# EAGLE design M7102 (EAGLE 6.6.0)
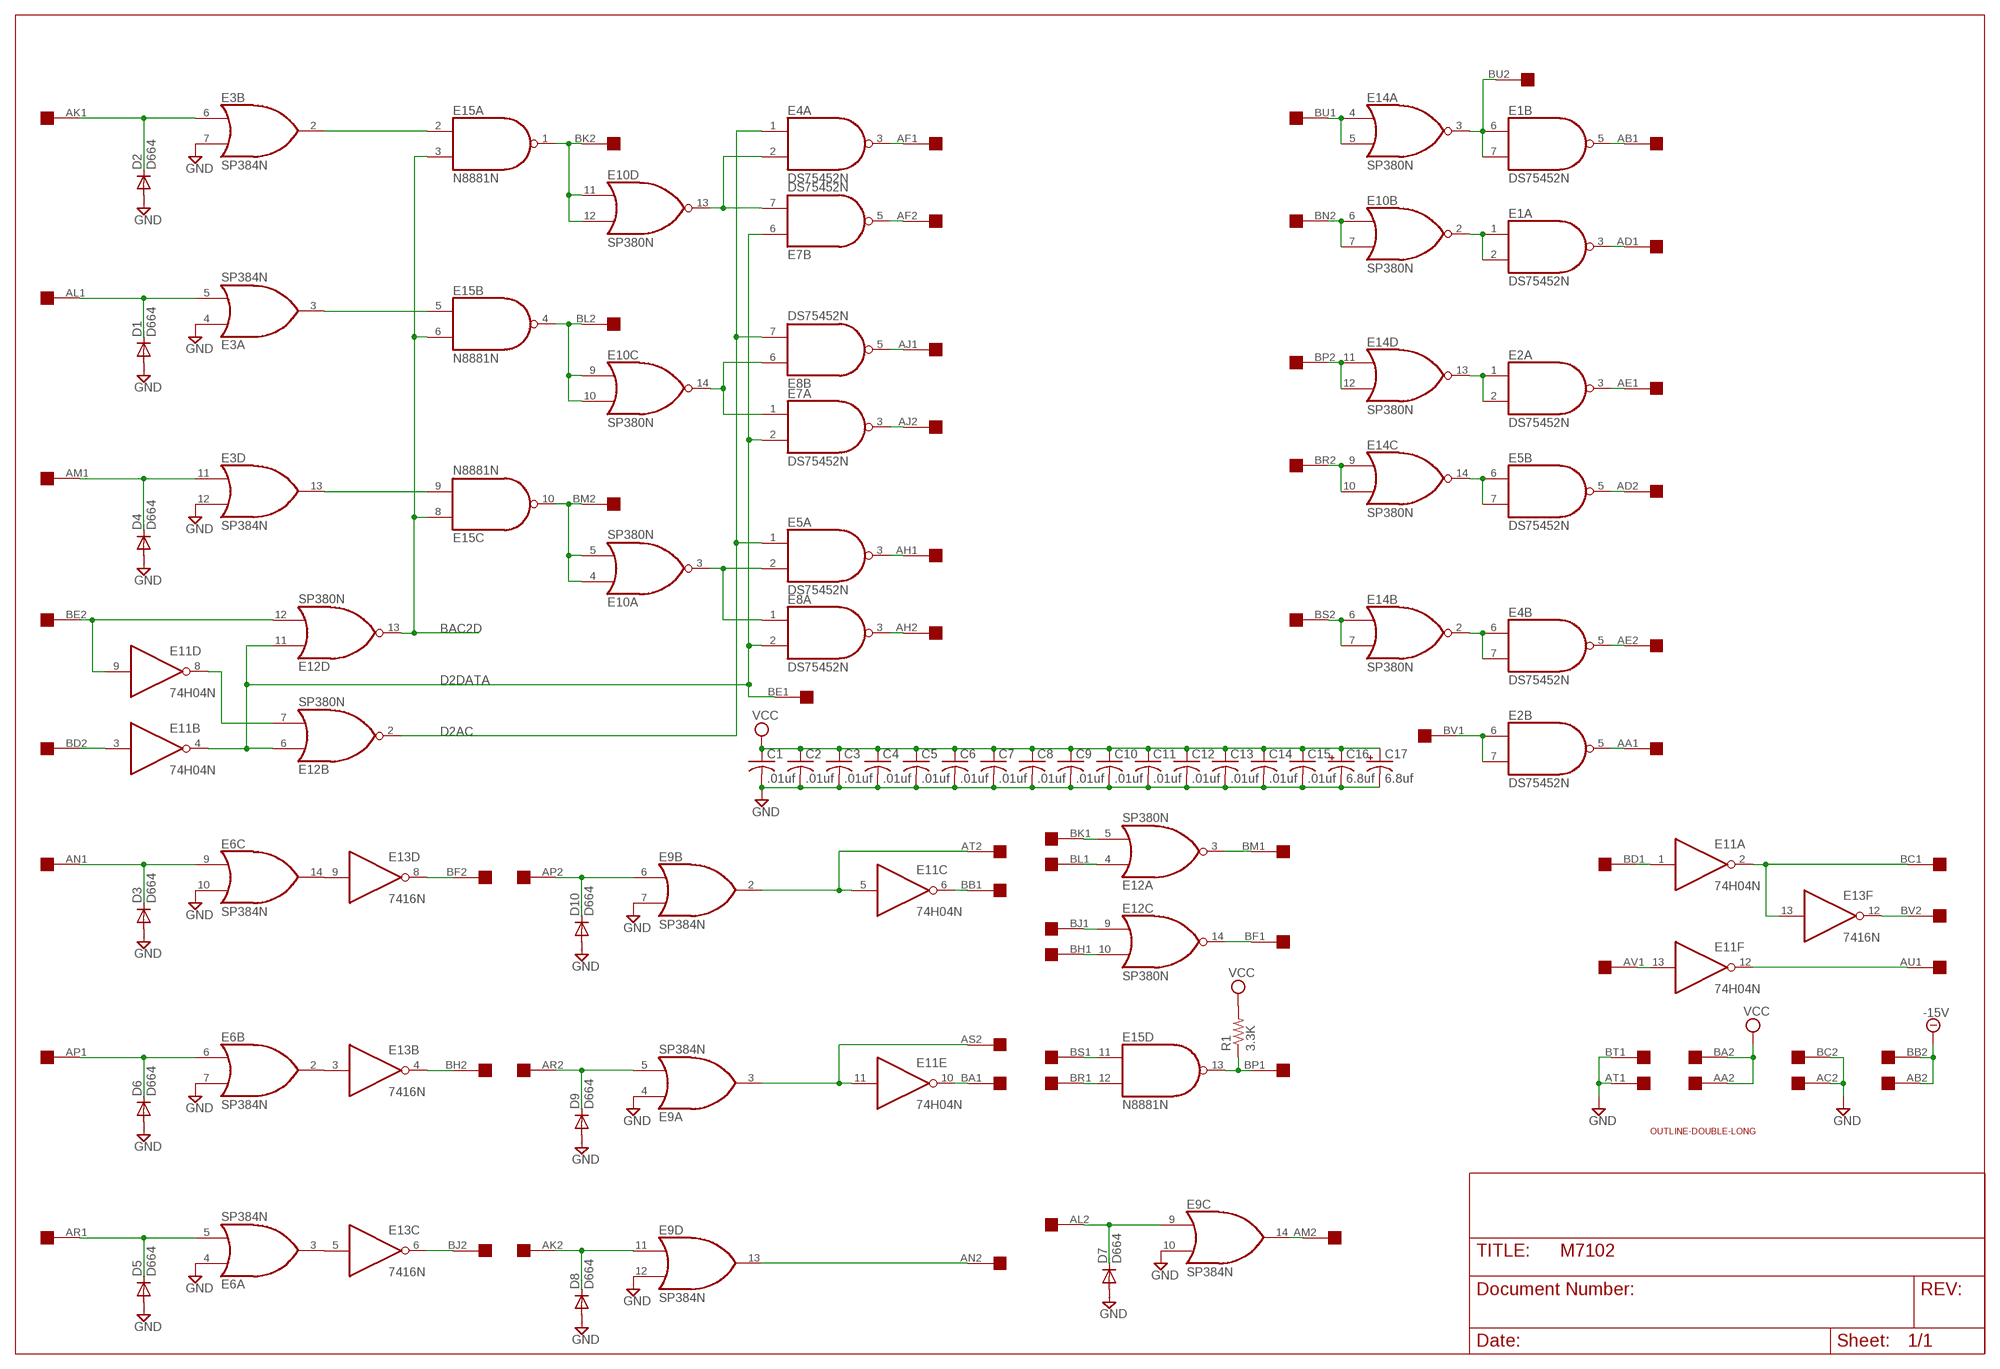
[diagram p0: schematic, sheet 1]

## Parts
C1  .01uf  C-US050-025X075  [C050-025X075]
C2  .01uf  C-US050-025X075  [C050-025X075]
C3  .01uf  C-US050-025X075  [C050-025X075]
C4  .01uf  C-US050-025X075  [C050-025X075]
C5  .01uf  C-US050-025X075  [C050-025X075]
C6  .01uf  C-US050-025X075  [C050-025X075]
C7  .01uf  C-US050-025X075  [C050-025X075]
C8  .01uf  C-US050-025X075  [C050-025X075]
C9  .01uf  C-US050-025X075  [C050-025X075]
C10  .01uf  C-US050-025X075  [C050-025X075]
C11  .01uf  C-US050-025X075  [C050-025X075]
C12  .01uf  C-US050-025X075  [C050-025X075]
C13  .01uf  C-US050-025X075  [C050-025X075]
C14  .01uf  C-US050-025X075  [C050-025X075]
C15  .01uf  C-US050-025X075  [C050-025X075]
C16  6.8uf  CPOL-USE15-5AXIAL  [E15-5]
C17  6.8uf  CPOL-USE15-5AXIAL  [E15-5]
D1  D664  1N4148DO35-10  [DO35-10]
D2  D664  1N4148DO35-10  [DO35-10]
D3  D664  1N4148DO35-10  [DO35-10]
D4  D664  1N4148DO35-10  [DO35-10]
D5  D664  1N4148DO35-10  [DO35-10]
D6  D664  1N4148DO35-10  [DO35-10]
D7  D664  1N4148DO35-10  [DO35-10]
D8  D664  1N4148DO35-10  [DO35-10]
D9  D664  1N4148DO35-10  [DO35-10]
D10  D664  1N4148DO35-10  [DO35-10]
E1  DS75452N  [DIL08]
E2  DS75452N  [DIL08]
E3  SP384N  [DIL14]
E4  DS75452N  [DIL08]
E5  DS75452N  [DIL08]
E6  SP384N  [DIL14]
E7  DS75452N  [DIL08]
E8  DS75452N  [DIL08]
E9  SP384N  [DIL14]
E10  SP380N  [DIL14]
E11  74H04N  7404N  [DIL14]
E12  SP380N  [DIL14]
E13  7416N  [DIL14]
E14  SP380N  [DIL14]
E15  N8881N  [DIL14]
EDGE  DOUBLE  [EDGE-CON4]
R1  3.3K  R-US_0207/10  [0207/10]
U$3  OUTLINE-DOUBLE-LONG  [DOUBLE-LONG]

## Nets
-15V [Supply]: EDGE.AB2 EDGE.BB2
AN1: D3.C E6.9(C:I0) EDGE.AN1
AP1: D6.C E6.6(B:I0) EDGE.AP1
AR1: D5.C E6.5(A:I1) EDGE.AR1
BAC2D: E12.13(D:O) E15.3(A:I1) E15.6(B:I1) E15.8(C:I0)
BD2: E11.3(B:I) EDGE.BD2
BE2: E11.9(D:I) E12.12(D:I1) EDGE.BE2
D2AC: E4.1(A:I0) E5.1(A:I0) E8.7(B:I1) E12.2(B:O)
D2DATA: E7.2(A:I1) E7.6(B:I0) E8.2(A:I1) E11.4(B:O) E12.6(B:I0) E12.11(D:I0) EDGE.BE1
GND [Supply]: C1.2 C2.2 C3.2 C4.2 C5.2 C6.2 C7.2 C8.2 C9.2 C10.2 C11.2 C12.2 C13.2 C14.2 C15.2 C16.- C17.- D1.A D2.A D3.A D4.A D5.A D6.A D7.A D8.A D9.A D10.A E3.4(A:I0) E3.7(B:I1) E3.12(D:I1) E6.4(A:I0) E6.7(B:I1) E6.10(C:I1) E9.4(A:I0) E9.7(B:I1) E9.10(C:I1) E9.12(D:I1) EDGE.AC2 EDGE.AT1 EDGE.BC2 EDGE.BT1
N$1: D4.C E3.11(D:I0) EDGE.AM1
N$2: D1.C E3.5(A:I1) EDGE.AL1
N$3: D2.C E3.6(B:I0) EDGE.AK1
N$4: E3.2(B:O) E15.2(A:I0)
N$5: E3.3(A:O) E15.5(B:I0)
N$6: E3.13(D:O) E15.9(C:I1)
N$7: E6.14(C:O) E13.9(D:I)
N$8: E6.2(B:O) E13.3(B:I)
N$9: E6.3(A:O) E13.5(C:I)
N$10: E4.3(A:O) EDGE.AF1
N$11: E7.5(B:O) EDGE.AF2
N$12: E8.5(B:O) EDGE.AJ1
N$13: E11.8(D:O) E12.7(B:I1)
N$14: D7.C E9.9(C:I0) EDGE.AL2
N$15: E10.4(A:I0) E10.5(A:I1) E15.10(C:O) EDGE.BM2
N$16: E10.9(C:I0) E10.10(C:I1) E15.4(B:O) EDGE.BL2
N$17: E10.11(D:I0) E10.12(D:I1) E15.1(A:O) EDGE.BK2
N$18: E13.6(C:O) EDGE.BJ2
N$19: E13.4(B:O) EDGE.BH2
N$20: E13.8(D:O) EDGE.BF2
N$21: E4.2(A:I1) E7.7(B:I1) E10.13(D:O)
N$22: E7.1(A:I0) E8.6(B:I0) E10.14(C:O)
N$23: E5.2(A:I1) E8.1(A:I0) E10.3(A:O)
N$24: E9.14(C:O) EDGE.AM2
N$25: D10.C E9.6(B:I0) EDGE.AP2
N$26: E5.3(A:O) EDGE.AH1
N$27: E7.3(A:O) EDGE.AJ2
N$28: E8.3(A:O) EDGE.AH2
N$29: E1.5(B:O) EDGE.AB1
N$30: E1.3(A:O) EDGE.AD1
N$31: E2.3(A:O) EDGE.AE1
N$32: E5.5(B:O) EDGE.AD2
N$33: E4.5(B:O) EDGE.AE2
N$34: E2.5(B:O) EDGE.AA1
N$35: D9.C E9.5(A:I1) EDGE.AR2
N$36: D8.C E9.11(D:I0) EDGE.AK2
N$37: E9.13(D:O) EDGE.AN2
N$38: E1.6(B:I0) E1.7(B:I1) E14.3(A:O) EDGE.BU2
N$39: E1.1(A:I0) E1.2(A:I1) E10.2(B:O)
N$40: E14.4(A:I0) E14.5(A:I1) EDGE.BU1
N$41: E10.6(B:I0) E10.7(B:I1) EDGE.BN2
N$66: E2.1(A:I0) E2.2(A:I1) E14.13(D:O)
N$67: E5.6(B:I0) E5.7(B:I1) E14.14(C:O)
N$68: E2.6(B:I0) E2.7(B:I1) EDGE.BV1
N$69: E4.6(B:I0) E4.7(B:I1) E14.2(B:O)
N$70: E14.6(B:I0) E14.7(B:I1) EDGE.BS2
N$71: E14.9(C:I0) E14.10(C:I1) EDGE.BR2
N$72: E14.11(D:I0) E14.12(D:I1) EDGE.BP2
N$74: E9.2(B:O) E11.5(C:I) EDGE.AT2
N$78: E9.3(A:O) E11.11(E:I) EDGE.AS2
N$88: E11.6(C:O) EDGE.BB1
N$89: E11.10(E:O) EDGE.BA1
N$91: E12.4(A:I0) EDGE.BL1
N$92: E12.5(A:I1) EDGE.BK1
N$93: E12.3(A:O) EDGE.BM1
N$94: E12.14(C:O) EDGE.BF1
N$95: E12.10(C:I1) EDGE.BH1
N$96: E12.9(C:I0) EDGE.BJ1
N$97: E15.11(D:I0) EDGE.BS1
N$98: E15.12(D:I1) EDGE.BR1
N$99: E15.13(D:O) EDGE.BP1 R1.1
N$100: E11.2(A:O) E13.13(F:I) EDGE.BC1
N$101: E11.1(A:I) EDGE.BD1
N$102: E11.13(F:I) EDGE.AV1
N$103: E11.12(F:O) EDGE.AU1
N$104: E13.12(F:O) EDGE.BV2
VCC [Supply]: C1.1 C2.1 C3.1 C4.1 C5.1 C6.1 C7.1 C8.1 C9.1 C10.1 C11.1 C12.1 C13.1 C14.1 C15.1 C16.+ C17.+ EDGE.AA2 EDGE.BA2 R1.2
Unconnected: E3.9(C:I0) E3.10(C:I1) E3.14(C:O) E6.11(D:I0) E6.12(D:I1) E6.13(D:O) E13.1(A:I) E13.2(A:O) E13.10(E:O) E13.11(E:I) EDGE.AC1 EDGE.AS1 EDGE.AU2 EDGE.AV2 EDGE.BN1 EDGE.BT2

## Power pins joined to a net without a drawn wire
GND: E1.4(P:GND) E2.4(P:GND) E3.1(GND) E4.4(P:GND) E5.4(P:GND) E6.1(GND) E7.4(P:GND) E8.4(P:GND) E9.1(GND) E10.1(P:GND) E11.7(P:GND) E12.1(P:GND) E13.7(P:GND) E14.1(P:GND) E15.7(P:GND)
VCC: E1.8(P:VCC) E2.8(P:VCC) E3.8(VCC) E4.8(P:VCC) E5.8(P:VCC) E6.8(VCC) E7.8(P:VCC) E8.8(P:VCC) E9.8(VCC) E10.8(P:VCC) E11.14(P:VCC) E12.8(P:VCC) E13.14(P:VCC) E14.8(P:VCC) E15.14(P:VCC)

## Library data of the parts
C1-C15 = rcl:C-US: CAPACITOR, American symbol
C16 C17 = rcl:CPOL-US: POLARIZED CAPACITOR, American symbol
D1-D10 = diode:1N4148: DIODE high speed (Philips)
E1 E2 E4 E5 E7 E8 = dec-con:DS75452: Quad 2-input NAND gate, open collector output
E3 E6 E9 = dec-con:SP384: Quad OR gate
E10 E12 E14 = dec-con:SP380: Quad NOR gate (use 8640)
E11 = 74xx-us:74*04: Hex INVERTER
E13 = 74xx-us:74*16: Hex INVERTER, open collector, high-voltage
E15 = dec-con:N8881: Quad 2-input NAND gate, open collector
EDGE = dec-con:DOUBLE: Double-Height DEC board
R1 = rcl:R-US_: RESISTOR, American symbol
U$3 = dec-con:OUTLINE-*: Board outlines for DEC boards.

## Net classes
1 Supply: width 0.635 mm

## Board
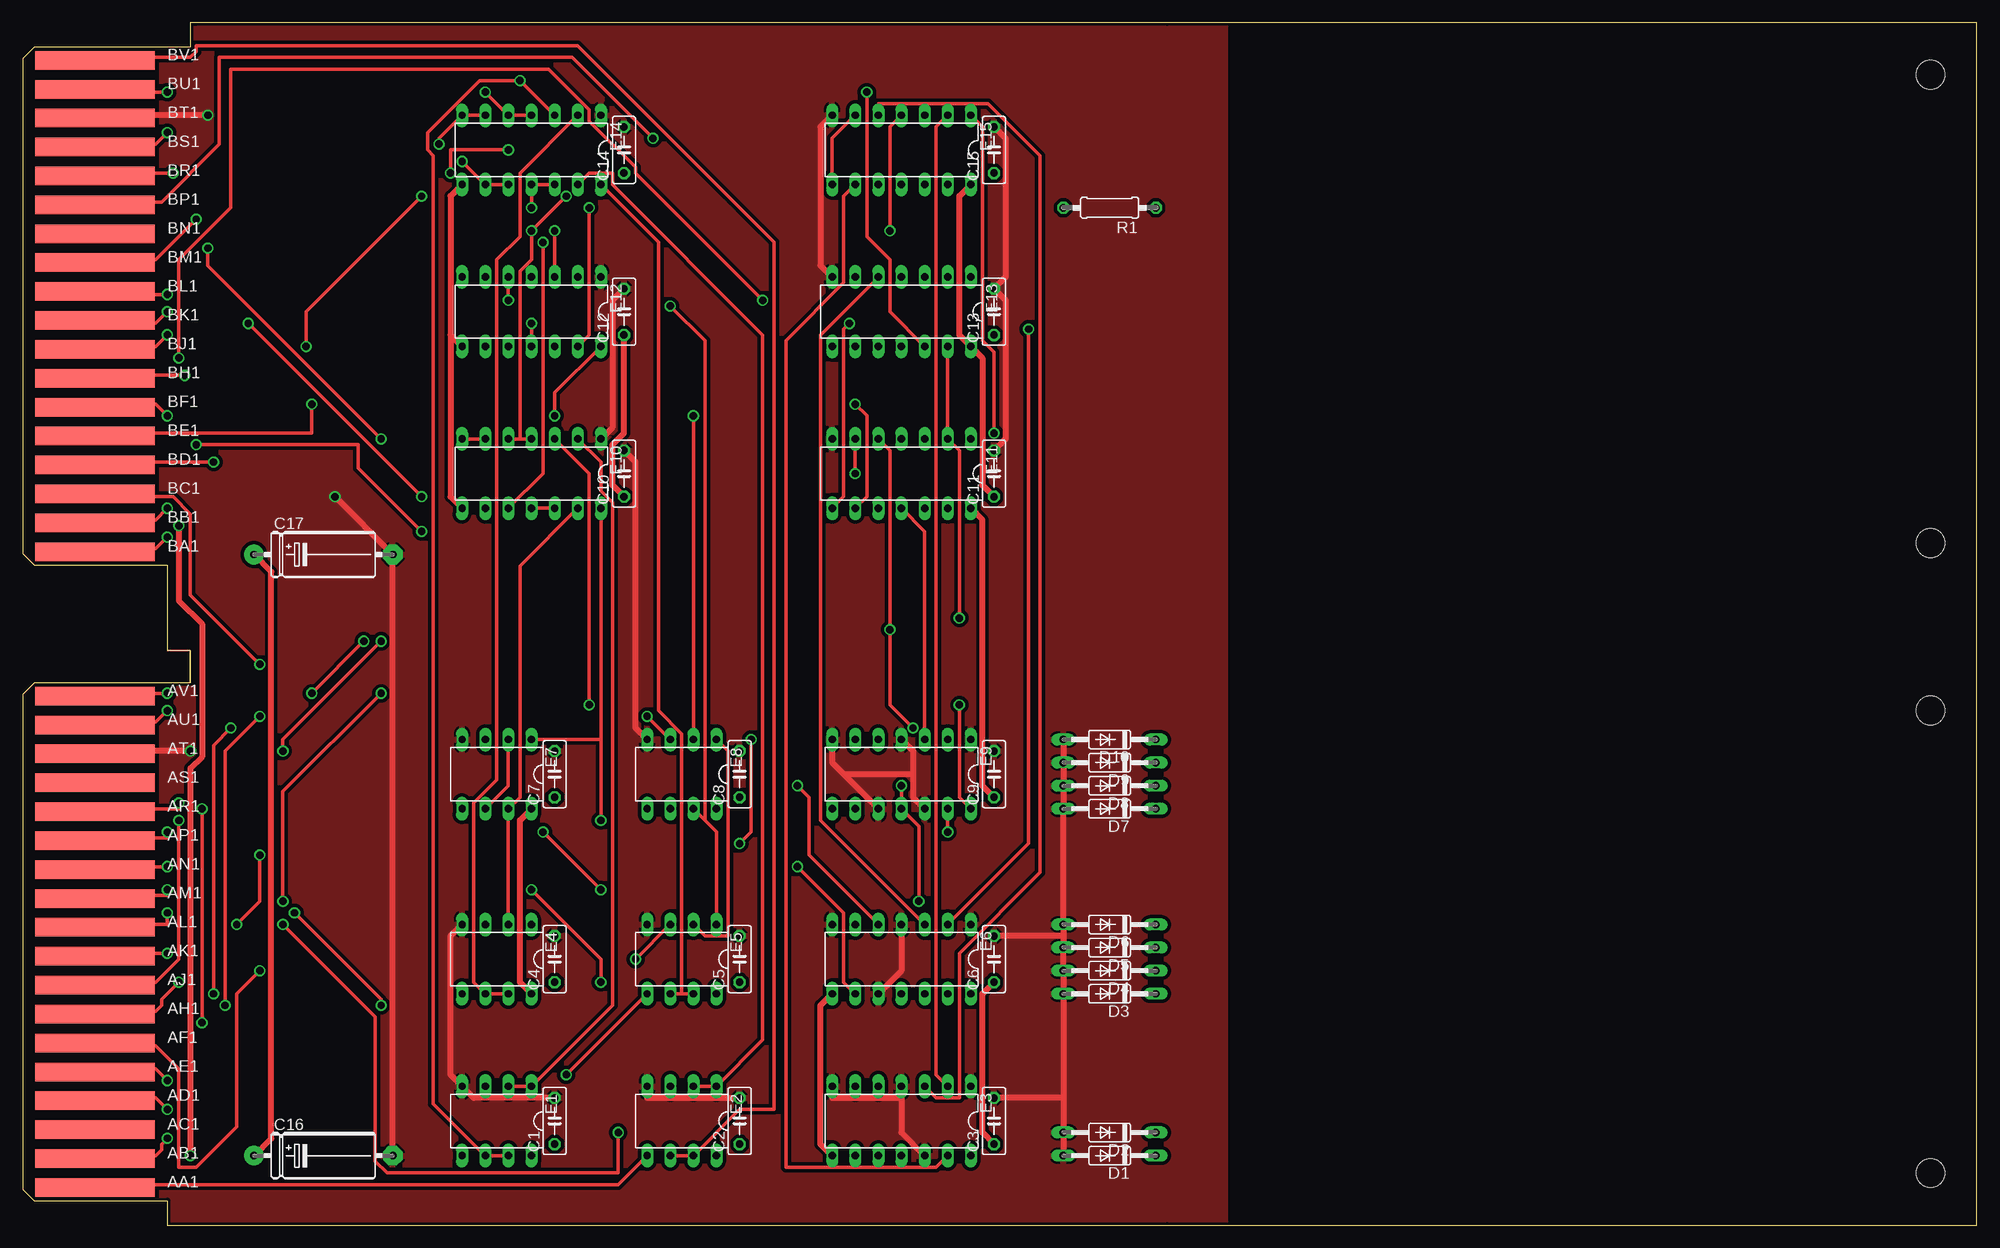
[diagram p1: board, top side]
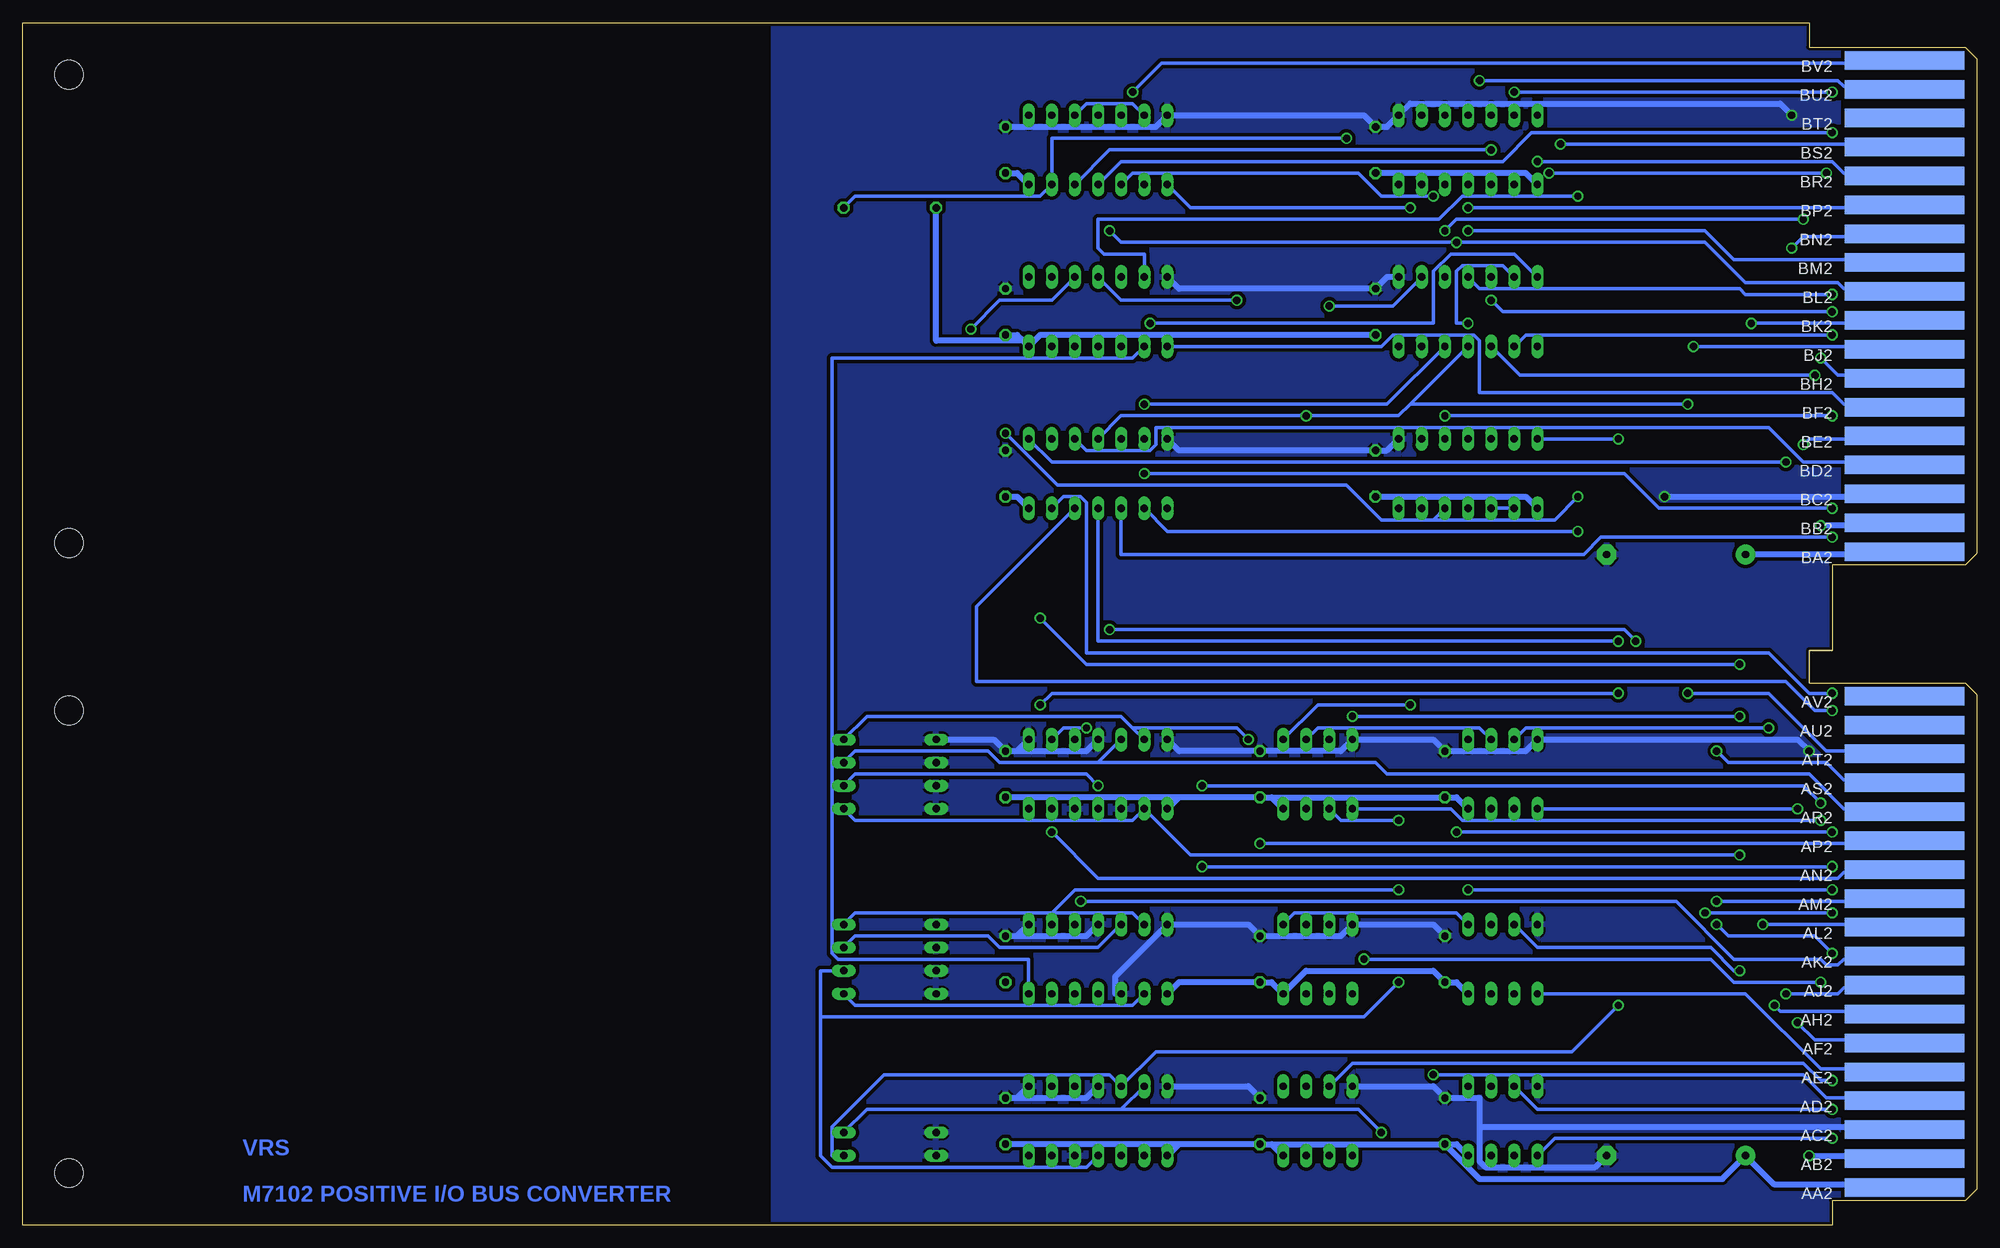
[diagram p2: board, bottom side, seen from below]

Size 214.63 x 132.08 mm. Coordinates in mm from the lower left corner, seen from the top.
Copper layers (1+16): Top 0.035mm / dielectric 1.5mm / Bottom 0.035mm
Design rules "16mils": minimum track width 16mil, minimum drill 32mil, track to track 15mil, track to pad 10mil, pad to pad 10mil, via to via 10mil, smd to smd 10mil, copper to edge 13mil, drill to drill 10mil, minimum pad ring 10mil, minimum via ring 8mil, stop-mask expansion 0mil, vias tented up to drill 0mil, thermal gap 10mil

### Footprints (pad centres in the part's own frame; a part is rotated, then mirrored left to right if it is on the bottom)
C050-025X075 = drill 0.813 octagon: 1 -2.54,0; 2 2.54,0
E15-5 = drill 0.813 pad 2.159: + -7.62,0 | drill 0.813 pad 2.159 octagon: - 7.62,0
DO35-10 = drill 0.813 long: A 5.08,0; C -5.08,0
DIL08 = drill 0.813 long: 1 -3.81,-3.81; 2 -1.27,-3.81; 3 1.27,-3.81; 4 3.81,-3.81; 5 3.81,3.81; 6 1.27,3.81; 7 -1.27,3.81; 8 -3.81,3.81
DIL14 = drill 0.813 long: 1 -7.62,-3.81; 2 -5.08,-3.81; 3 -2.54,-3.81; 4 0,-3.81; 5 2.54,-3.81; 6 5.08,-3.81; 7 7.62,-3.81; 8 7.62,3.81; 9 5.08,3.81; 10 2.54,3.81; 11 0,3.81; 12 -2.54,3.81; 13 -5.08,3.81; 14 -7.62,3.81
EDGE-CON4 = smd 13.106 x 2.032: AA1 7.938,4.128; AB1 7.938,7.303; AC1 7.938,10.477; AD1 7.938,13.652; AE1 7.938,16.828; AF1 7.938,20.003; AH1 7.938,23.177; AJ1 7.938,26.352; AK1 7.938,29.527; AL1 7.938,32.703; AM1 7.938,35.877; AN1 7.938,39.053; AP1 7.938,42.227; AR1 7.938,45.403; AS1 7.938,48.578; AT1 7.938,51.752; AU1 7.938,54.928; AV1 7.938,58.102; BA1 7.938,73.978; BB1 7.938,77.153; BC1 7.938,80.328; BD1 7.938,83.502; BE1 7.938,86.677; BF1 7.938,89.853; BH1 7.938,93.028; BJ1 7.938,96.203; BK1 7.938,99.377; BL1 7.938,102.552; BM1 7.938,105.728; BN1 7.938,108.903; BP1 7.938,112.078; BR1 7.938,115.252; BS1 7.938,118.427; BT1 7.938,121.603; BU1 7.938,124.778; BV1 7.938,127.953 | smd 13.106 x 2.032 bottom: AA2 7.938,4.128; AB2 7.938,7.303; AC2 7.938,10.477; AD2 7.938,13.652; AE2 7.938,16.828; AF2 7.938,20.003; AH2 7.938,23.177; AJ2 7.938,26.352; AK2 7.938,29.527; AL2 7.938,32.703; AM2 7.938,35.877; AN2 7.938,39.053; AP2 7.938,42.227; AR2 7.938,45.403; AS2 7.938,48.578; AT2 7.938,51.752; AU2 7.938,54.928; AV2 7.938,58.102; BA2 7.938,73.978; BB2 7.938,77.153; BC2 7.938,80.328; BD2 7.938,83.502; BE2 7.938,86.677; BF2 7.938,89.853; BH2 7.938,93.028; BJ2 7.938,96.203; BK2 7.938,99.377; BL2 7.938,102.552; BM2 7.938,105.728; BN2 7.938,108.903; BP2 7.938,112.078; BR2 7.938,115.252; BS2 7.938,118.427; BT2 7.938,121.603; BU2 7.938,124.778; BV2 7.938,127.953
0207/10 = drill 0.813 octagon: 1 -5.08,0; 2 5.08,0
DOUBLE-LONG = hole 3.175: 209.55,56.515; 209.55,5.715; 209.55,74.93; 209.55,126.365

### Placement (x,y rotation side)
C1  58.42,11.43 90 top
C2  78.74,11.43 90 top
C3  106.68,11.43 90 top
C4  58.42,29.21 90 top
C5  78.74,29.21 90 top
C6  106.68,29.21 90 top
C7  58.42,49.53 90 top
C8  78.74,49.53 90 top
C9  106.68,49.53 90 top
C10  66.04,82.55 90 top
C11  106.68,82.55 90 top
C12  66.04,100.33 90 top
C13  106.68,100.33 90 top
C14  66.04,118.11 90 top
C15  106.68,118.11 90 top
C16  33.02,7.62 0 top
C17  33.02,73.66 0 top
D1  119.38,7.62 180 top
D2  119.38,10.16 180 top
D3  119.38,25.4 180 top
D4  119.38,27.94 180 top
D5  119.38,30.48 180 top
D6  119.38,33.02 180 top
D7  119.38,45.72 180 top
D8  119.38,48.26 180 top
D9  119.38,50.8 180 top
D10  119.38,53.34 180 top
E1  52.07,11.43 180 top
E2  72.39,11.43 180 top
E3  96.52,11.43 180 top
E4  52.07,29.21 180 top
E5  72.39,29.21 180 top
E6  96.52,29.21 180 top
E7  52.07,49.53 180 top
E8  72.39,49.53 180 top
E9  96.52,49.53 180 top
E10  55.88,82.55 180 top
E11  96.52,82.55 180 top
E12  55.88,100.33 180 top
E13  96.52,100.33 180 top
E14  55.88,118.11 180 top
E15  96.52,118.11 180 top
EDGE  0,0 0 top
R1  119.38,111.76 180 top
U$3  0,0 0 top

### Tracks (layer width: path | path; a pad name or v marks a point on that pad's centre or on a via)
-15V  (via drill 0.81)
  Top 0.635: v18.42,7.62 18.42,50.16 19.69,51.44 19.69,66.04 17.15,68.58 v17.15,76.83
  Bottom 0.635: v18.42,7.62 8.26,7.62 EDGE.AB2 | v17.15,76.83 8.26,76.83 EDGE.BB2
AN1  (via drill 0.81)
  Top 0.406: v15.88,39.37 8.26,39.37 EDGE.AN1 | v85.09,39.37 90.17,34.29 90.17,26.67 E6.9
  Bottom 0.406: E6.9 92.71,24.13 123.19,24.13 D3.C | v85.09,39.37 v15.88,39.37
AP1  (via drill 0.81)
  Top 0.406: v15.88,43.18 15.88,42.55 8.26,42.55 EDGE.AP1 | v63.5,36.83 v57.15,43.18
  Bottom 0.406: E6.6 92.71,34.29 101.6,34.29 | 101.6,34.29 123.19,34.29 D6.C | v57.15,43.18 v15.88,43.18 | v63.5,36.83 99.06,36.83 101.6,34.29
AR1  (via drill 0.81)
  Top 0.406: v17.15,46.35 17.15,45.72 8.26,45.72 EDGE.AR1 | v85.09,48.26 86.36,46.99 86.36,40.64 E6.5
  Bottom 0.406: D5.C 123.19,31.75 108.59,31.75 107.32,30.48 96.52,30.48 E6.5 | v17.15,46.35 19.05,48.26 v85.09,48.26
BAC2D  (via drill 0.81)
  Top 0.406: E12.13 62.23,97.79 v62.23,111.76 | E15.6 88.9,119.38 E15.8
  Bottom 0.406: v62.23,111.76 86.36,111.76 E15.8 | E15.3 97.79,123.19 92.71,123.19 E15.6
BD2
  Bottom 0.406: E11.3 97.79,85.09 90.81,85.09 90.17,85.72 90.17,87.63 22.86,87.63 19.05,83.82 8.26,83.82 EDGE.BD2
BE2  (via drill 0.81)
  Top 0.406: v91.44,90.17 92.71,88.9 92.71,80.01 E11.9 | v19.05,85.72 36.83,85.72 36.83,83.19 v43.82,76.2
  Bottom 0.406: E12.12 64.77,90.17 v91.44,90.17 | v19.05,85.72 18.42,86.36 8.26,86.36 EDGE.BE2 | v43.82,76.2 88.9,76.2 E11.9
D2AC  (via drill 0.81)
  Top 0.406: 74.93,44.45 76.2,43.18 E5.1 | 74.93,44.45 E8.7 | v71.12,100.97 74.93,97.16 74.93,44.45
  Bottom 0.406: E4.1 57.15,34.29 74.93,34.29 E5.1 | E12.2 64.14,100.97 v71.12,100.97
D2DATA  (via drill 0.81)
  Top 0.406: E7.6 53.34,48.26 E7.2 | E12.11 v55.88,99.06 | v73.66,88.9 E8.2 | v31.75,90.17 31.75,87 8.26,87 EDGE.BE1
  Bottom 0.406: E8.2 72.39,54.61 54.61,54.61 E7.2 | E12.6 52.07,105.41 56.52,105.41 57.15,104.78 57.15,99.06 v55.88,99.06 | E11.4 93.98,88.9 v73.66,88.9 63.5,88.9 62.23,90.17 | E12.11 62.23,90.17 | 62.23,90.17 v31.75,90.17
GND  (via drill 0.81)
  Top 0.635: E10.1 64.77,87.63 64.77,101.6 C12.2 | C11.2 107.95,86.36 107.95,101.6 C13.2 107.95,104.14 107.95,119.38 C15.2 | v20.32,121.92 8.26,121.92 EDGE.BT1 | E13.7 87.63,105.41 87.63,120.65 E15.7 | E9.12 97.79,46.99 97.79,49.53 | 97.79,49.53 97.79,52.07 E9.4 | 90.17,49.53 88.9,50.8 E9.7 | 90.17,49.53 E9.10 | 90.17,49.53 97.79,49.53 | D10.A D9.A D8.A D7.A D6.A 114.3,31.75 | v18.42,52.07 8.26,52.07 EDGE.AT1 | E3.12 96.52,10.16 96.52,13.97 | E3.4 96.52,13.97 | 96.52,13.97 88.9,13.97 E3.7 | E6.10 96.52,27.94 E6.4 | 114.3,31.75 D5.A D4.A D3.A 114.3,13.97 | D1.A D2.A 114.3,13.97 | 114.3,13.97 C3.2 | 114.3,31.75 C6.2 | C1.2 49.53,13.97 E1.4 46.99,16.51 46.99,31.75 E4.4 | C16.- C17.- v34.29,80.01 | C2.2 68.58,13.97 E2.4 | C10.2 67.31,83.82 67.31,54.61 E8.4
  Bottom 0.635: E10.1 64.77,85.09 C10.2 87.63,85.09 E11.7 | E12.1 64.77,104.14 C12.2 87.63,102.87 E13.7 | C15.2 90.17,120.65 E15.7 67.31,121.92 C14.2 64.77,120.65 E14.1 62.23,123.19 21.59,123.19 v20.32,121.92 | 105.41,52.07 E9.1 | 105.41,52.07 C9.2 107.95,53.34 D10.A | E9.4 97.79,52.07 105.41,52.07 | v18.42,52.07 19.69,53.34 E7.4 49.53,52.07 C7.2 59.69,53.34 E8.4 69.85,52.07 C8.2 87.63,52.07 E9.7 | C4.2 59.69,33.02 E5.4 69.85,31.75 C5.2 80.01,33.02 E6.7 94.62,27.3 94.62,25.4 E6.10 | C2.2 80.01,15.24 E3.7 | 105.41,31.75 E6.1 | C6.2 105.41,31.75 | 105.41,13.97 E3.1 | C3.2 105.41,13.97 | E6.4 97.79,31.75 105.41,31.75 | E3.4 97.79,13.97 105.41,13.97 | E2.4 59.69,15.24 C1.2 54.61,13.97 54.61,10.79 | C16.- 41.91,6.35 53.98,6.35 54.61,6.99 54.61,10.79 | 54.61,10.79 8.26,10.79 EDGE.AC2 | v34.29,80.01 8.26,80.01 EDGE.BC2
  pour Bottom (isolate 0.305): 15.24,0 132.08,0 132.08,132.08 15.24,132.08
  pour Top (isolate 0.305): 15.24,0 132.08,0 132.08,132.08 15.24,132.08
N$1  (via drill 0.81)
  Top 0.406: v15.88,36.83 15.88,36.2 8.26,36.2 EDGE.AM1 | v55.88,36.83 63.5,29.21 v63.5,26.67
  Bottom 0.406: E3.11 97.79,6.35 125.73,6.35 127,7.62 127,22.86 | 127,22.86 127,27.94 D4.C | v55.88,36.83 v15.88,36.83 | v63.5,26.67 67.31,22.86 127,22.86
N$2  (via drill 0.81)
  Top 0.406: v15.88,34.29 15.88,33.02 8.26,33.02 EDGE.AL1 | v29.85,34.29 39.37,24.77 v39.37,24.13
  Bottom 0.406: D1.C 125.73,7.62 125.73,10.79 120.02,16.51 95.25,16.51 E3.5 90.17,19.05 44.45,19.05 v39.37,24.13 | v29.85,34.29 v15.88,34.29
N$3  (via drill 0.81)
  Top 0.406: v15.88,29.84 8.26,29.84 EDGE.AK1 | v28.58,33.02 38.74,22.86 38.74,6.99 40.01,5.71 65.41,5.71 v65.41,10.16
  Bottom 0.406: D2.C 121.92,12.7 93.98,12.7 | E3.6 93.98,12.7 | v15.88,29.84 17.78,31.75 27.31,31.75 v28.58,33.02 | v65.41,10.16 67.95,12.7 93.98,12.7
N$4
  Top 0.406: E3.2 100.33,16.51 100.33,120.65 E15.2
N$5
  Top 0.406: E3.3 100.33,13.97 102.87,13.97 102.87,29.84 111.76,38.73 111.76,117.47 106.05,123.19 93.98,123.19 E15.5
N$6
  Top 0.406: E3.13 100.33,6.35 83.82,6.35 83.82,97.16 90.17,103.5 90.17,113.03 E15.9
N$7
  Bottom 0.406: E6.14 104.14,29.21 125.1,29.21 125.73,29.84 125.73,95.25 92.71,95.25 E13.9
N$8  (via drill 0.81)
  Top 0.406: E6.2 110.49,41.91 v110.49,98.42
  Bottom 0.406: v110.49,98.42 107.32,101.6 101.6,101.6 E13.3
N$9
  Top 0.406: E6.3 87.63,44.45 87.63,97.79 E13.5
N$10  (via drill 0.81)
  Top 0.406: v26.04,27.94 23.5,25.4 23.5,10.79 19.05,6.35 17.15,6.35 17.15,17.14 14.61,19.68 8.26,19.68 EDGE.AF1
  Bottom 0.406: E4.3 48.26,30.48 29.21,30.48 26.67,27.94 v26.04,27.94
N$11  (via drill 0.81)
  Top 0.406: v19.69,22.23 v19.69,45.72
  Bottom 0.406: v19.69,45.72 E7.5 | v19.69,22.23 17.78,20.32 8.26,20.32 EDGE.AF2
N$12  (via drill 0.81)
  Top 0.406: v17.15,44.45 17.15,29.21 14.61,26.67 8.26,26.67 EDGE.AJ1
  Bottom 0.406: E8.5 57.79,45.72 56.52,44.45 v17.15,44.45
N$13  (via drill 0.81)
  Top 0.406: v90.81,99.06 90.17,98.42 90.17,80.01 E11.8
  Bottom 0.406: E12.7 50.8,106.68 57.79,106.68 59.69,104.78 59.69,99.06 v90.81,99.06
N$14  (via drill 0.81)
  Top 0.406: v23.5,33.02 26.04,35.56 v26.04,40.64
  Bottom 0.406: D7.C 123.19,44.45 92.71,44.45 E9.9 86.36,40.64 v26.04,40.64 | v23.5,33.02 8.26,33.02 EDGE.AL2
N$15  (via drill 0.81)
  Top 0.406: E10.4 54.61,86.36 | 54.61,86.36 E10.5 | v59.69,113.03 v55.88,109.22 55.88,106.05 54.61,104.78 54.61,86.36
  Bottom 0.406: E15.10 92.71,115.57 67.95,115.57 65.41,113.03 v59.69,113.03 | v55.88,109.22 29.85,109.22 26.67,106.05 8.26,106.05 EDGE.BM2
N$16  (via drill 0.81)
  Top 0.406: E15.4 95.25,120.65 v95.25,109.22 | E10.10 57.15,82.55 v57.15,107.95
  Bottom 0.406: E10.10 E10.9 | v95.25,109.22 93.98,107.95 v57.15,107.95 29.85,107.95 25.4,103.5 15.24,103.5 14.61,102.87 8.26,102.87 EDGE.BL2
N$17  (via drill 0.81)
  Top 0.406: E10.12 E10.11 | E15.1 105.41,120.65 105.41,97.16 106.68,95.89 v106.68,87 | v43.82,80.01 v24.77,99.06
  Bottom 0.406: v106.68,87 100.97,81.28 69.22,81.28 65.41,77.47 59.69,77.47 | E10.12 59.69,77.47 | v24.77,99.06 8.26,99.06 EDGE.BK2 | v43.82,80.01 46.36,77.47 59.69,77.47
N$18  (via drill 0.81)
  Top 0.406: v43.82,113.03 31.12,100.33 v31.12,96.52
  Bottom 0.406: E13.6 91.44,106.68 95.89,106.68 96.52,107.31 96.52,110.49 59.06,110.49 56.52,113.03 v43.82,113.03 | v31.12,96.52 8.26,96.52 EDGE.BJ2
N$19  (via drill 0.81)
  Top 0.406: v81.28,101.6 67.31,115.57 67.31,116.2 62.23,121.28 62.23,122.56 57.79,127 22.86,127 22.86,111.76 17.15,106.05 v17.15,95.25
  Bottom 0.406: E13.4 93.98,101.6 v81.28,101.6 | v17.15,95.25 15.24,93.34 8.26,93.34 EDGE.BH2
N$20
  Bottom 0.406: E13.8 65.41,96.52 64.14,97.79 55.25,97.79 54.61,97.16 54.61,91.44 15.88,91.44 14.61,90.17 8.26,90.17 EDGE.BF2
N$21
  Top 0.406: E4.2 E7.7 54.61,46.99 54.61,72.39 E10.13
N$22  (via drill 0.81)
  Top 0.406: 63.5,53.34 E7.1 | E10.14 63.5,53.34 | 63.5,53.34 v63.5,44.45
  Bottom 0.406: E8.6 69.85,44.45 v63.5,44.45
N$23  (via drill 0.81)
  Top 0.406: E5.2 74.93,31.75 77.47,31.75 77.47,52.07 E8.1 | E10.3 62.23,82.55 v62.23,57.15
  Bottom 0.406: v62.23,57.15 72.39,57.15 E8.1
N$24  (via drill 0.81)
  Top 0.406: E9.14 102.87,46.99 v102.87,57.15 | v39.37,58.42 28.58,47.62 v28.58,35.56
  Bottom 0.406: v102.87,57.15 101.6,58.42 v39.37,58.42 | v28.58,35.56 8.26,35.56 EDGE.AM2
N$25  (via drill 0.81)
  Top 0.406: v78.74,41.91 80.01,43.18 v80.01,53.34
  Bottom 0.406: 92.71,54.61 93.98,55.88 121.92,55.88 D10.C | 92.71,54.61 E9.6 | v78.74,41.91 8.26,41.91 EDGE.AP2 | v80.01,53.34 81.28,54.61 92.71,54.61
N$26  (via drill 0.81)
  Top 0.406: v67.31,29.21 E5.3 | v17.15,26.67 15.24,24.77 15.24,24.13 14.61,23.5 8.26,23.5 EDGE.AH1
  Bottom 0.406: v67.31,29.21 29.21,29.21 26.67,26.67 v17.15,26.67
N$27  (via drill 0.81)
  Top 0.406: v22.86,54.61 20.96,52.7 v20.96,25.4
  Bottom 0.406: E7.3 49.53,54.61 v22.86,54.61 | v20.96,25.4 15.24,25.4 14.61,26.04 8.26,26.04 EDGE.AJ2
N$28  (via drill 0.81)
  Top 0.406: v68.58,55.88 E8.3 | v26.04,55.88 22.23,52.07 v22.23,24.13
  Bottom 0.406: v26.04,55.88 v68.58,55.88 | v22.23,24.13 21.59,23.5 8.26,23.5 EDGE.AH2
N$29  (via drill 0.81)
  Top 0.406: v15.88,9.53 15.24,8.89 15.24,8.26 14.61,7.62 8.26,7.62 EDGE.AB1
  Bottom 0.406: E1.5 46.36,9.53 v15.88,9.53
N$30  (via drill 0.81)
  Top 0.406: v15.88,12.7 14.61,13.97 8.26,13.97 EDGE.AD1
  Bottom 0.406: E1.3 48.26,12.7 v15.88,12.7
N$31  (via drill 0.81)
  Top 0.406: v15.88,15.88 14.61,17.14 8.26,17.14 EDGE.AE1
  Bottom 0.406: E2.3 68.58,17.78 19.05,17.78 17.15,15.88 v15.88,15.88
N$32  (via drill 0.81)
  Top 0.406: v59.69,16.51 E5.5
  Bottom 0.406: v59.69,16.51 19.05,16.51 16.51,13.97 8.26,13.97 EDGE.AD2
N$33
  Bottom 0.406: E4.5 25.4,25.4 17.15,17.14 8.26,17.14 EDGE.AE2
N$34
  Top 0.406: E2.5 65.41,4.45 8.26,4.45 EDGE.AA1
N$35
  Bottom 0.406: D9.C 123.19,52.07 108.59,52.07 107.32,50.8 96.52,50.8 | E9.5 96.52,50.8 | 96.52,50.8 66.04,50.8 64.77,49.53 18.42,49.53 14.61,45.72 8.26,45.72 EDGE.AR2
N$36  (via drill 0.81)
  Top 0.406: v96.52,48.26 E9.11 98.43,43.81 v98.43,35.56
  Bottom 0.406: v96.52,48.26 97.79,49.53 123.19,49.53 D8.C | v98.43,35.56 33.02,35.56 26.67,29.21 17.15,29.21 16.51,28.57 15.24,28.57 14.61,29.21 8.26,29.21 EDGE.AK2
N$37  (via drill 0.81)
  Top 0.406: v101.6,43.18 E9.13
  Bottom 0.406: v101.6,43.18 96.52,38.1 15.24,38.1 14.61,38.73 8.26,38.73 EDGE.AN2
N$38  (via drill 0.81)
  Top 0.406: E1.7 E1.6 45.09,13.34 45.09,117.47 44.45,118.11 44.45,120.02 50.17,125.73 v54.61,125.73 E14.3
  Bottom 0.406: v54.61,125.73 15.24,125.73 14.61,125.09 8.26,125.09 EDGE.BU2
N$39
  Top 0.406: E1.2 E1.1 64.77,24.13 64.77,79.38 63.5,80.64 63.5,83.82 E10.2
N$40  (via drill 0.81)
  Top 0.406: E14.4 E14.5 v50.8,124.46 | v15.88,124.46 8.26,124.46 EDGE.BU1
  Bottom 0.406: v15.88,124.46 v50.8,124.46
N$41  (via drill 0.81)
  Top 0.406: E10.6 E10.7 | v39.37,86.36 20.32,105.41 v20.32,107.31
  Bottom 0.406: v39.37,86.36 E10.7 | v20.32,107.31 19.05,108.58 8.26,108.58 EDGE.BN2
N$66
  Top 0.406: E2.2 E2.1 81.28,20.32 81.28,97.79 64.77,114.3 64.77,115.57 62.23,115.57 E14.13
N$67
  Top 0.406: E5.7 72.39,25.4 | 72.39,25.4 E5.6 | E14.14 69.85,107.95 69.85,56.52 72.39,53.98 72.39,25.4
N$68
  Top 0.406: E2.6 E2.7 78.74,12.7 82.55,12.7 82.55,107.95 60.96,129.54 19.05,129.54 19.05,128.91 18.42,128.27 8.26,128.27 EDGE.BV1
N$69
  Top 0.406: E4.7 E4.6 49.53,26.67 49.53,46.35 52.07,48.9 52.07,106.05 54.61,108.58 54.61,115.57 E14.2
N$70  (via drill 0.81)
  Top 0.406: E14.6 E14.7 45.72,119.38 v45.72,118.75
  Bottom 0.406: v45.72,118.75 8.26,118.75 EDGE.BS2
N$71  (via drill 0.81)
  Top 0.406: E14.10 E14.9 v48.26,116.84
  Bottom 0.406: v48.26,116.84 15.88,116.84 14.61,115.57 8.26,115.57 EDGE.BR2
N$72  (via drill 0.81)
  Top 0.406: E14.12 E14.11 v55.88,111.76
  Bottom 0.406: v55.88,111.76 8.26,111.76 EDGE.BP2
N$74  (via drill 0.81)
  Top 0.406: v97.79,54.61 95.25,57.15 v95.25,65.41 95.25,85.09 E11.5 | v37.47,64.14 v31.75,58.42
  Bottom 0.406: E9.2 100.33,54.61 v97.79,54.61 | v31.75,58.42 22.86,58.42 16.51,52.07 8.26,52.07 EDGE.AT2 | v37.47,64.14 38.74,65.41 v95.25,65.41
N$78  (via drill 0.81)
  Top 0.406: E9.3 99.06,76.2 E11.11 | v39.37,64.14 28.58,53.34 v28.58,52.07
  Bottom 0.406: E11.11 96.52,64.14 v39.37,64.14 | v28.58,52.07 27.31,50.8 16.51,50.8 14.61,48.9 8.26,48.9 EDGE.AS2
N$88  (via drill 0.81)
  Top 0.406: v91.44,82.55 E11.6 | v15.88,78.74 14.61,77.47 8.26,77.47 EDGE.BB1
  Bottom 0.406: v91.44,82.55 38.74,82.55 34.93,78.74 v15.88,78.74
N$89  (via drill 0.81)
  Top 0.406: v15.88,75.56 14.61,74.3 8.26,74.3 EDGE.BA1
  Bottom 0.406: E11.10 93.98,73.66 43.18,73.66 41.28,75.56 v15.88,75.56
N$91  (via drill 0.81)
  Top 0.406: v15.88,102.23 8.26,102.23 EDGE.BL1
  Bottom 0.406: E12.4 54.61,102.87 26.04,102.87 25.4,102.23 v15.88,102.23
N$92  (via drill 0.81)
  Top 0.406: v53.34,101.6 E12.5 | v15.88,100.33 14.61,99.06 8.26,99.06 EDGE.BK1
  Bottom 0.406: v53.34,101.6 52.07,100.33 v15.88,100.33
N$93  (via drill 0.81)
  Top 0.406: v58.42,109.22 E12.3 | v19.05,110.49 14.61,106.05 8.26,106.05 EDGE.BM1
  Bottom 0.406: v58.42,109.22 57.15,110.49 v19.05,110.49
N$94  (via drill 0.81)
  Top 0.406: E12.14 58.42,91.44 v58.42,88.9 | v15.88,88.9 14.61,90.17 8.26,90.17 EDGE.BF1
  Bottom 0.406: v15.88,88.9 v58.42,88.9
N$95  (via drill 0.81)
  Top 0.406: v17.78,93.34 8.26,93.34 EDGE.BH1
  Bottom 0.406: E12.10 50.17,93.34 v17.78,93.34
N$96  (via drill 0.81)
  Top 0.406: v15.88,97.79 14.61,96.52 8.26,96.52 EDGE.BJ1
  Bottom 0.406: E12.9 49.53,97.79 v15.88,97.79
N$97  (via drill 0.81)
  Top 0.406: v15.88,120.02 14.61,118.75 8.26,118.75 EDGE.BS1
  Bottom 0.406: E15.11 93.98,116.84 52.07,116.84 48.9,120.02 v15.88,120.02
N$98  (via drill 0.81)
  Top 0.406: v53.34,118.11 46.99,118.11 v46.99,115.57 | v16.51,115.57 8.26,115.57 EDGE.BR1
  Bottom 0.406: E15.12 95.25,118.11 v53.34,118.11 | v16.51,115.57 v46.99,115.57
N$99  (via drill 0.81)
  Top 0.406: v69.22,119.38 60.33,128.27 21.59,128.27 21.59,118.75 15.24,112.39 8.26,112.39 EDGE.BP1
  Bottom 0.406: R1.1 123.19,113.03 102.87,113.03 E15.13 101.6,119.38 v69.22,119.38
N$100  (via drill 0.81)
  Top 0.406: E13.13 E11.2 102.87,85.09 v102.87,66.67 | v26.04,61.59 18.42,69.22 18.42,78.11 16.51,80.01 8.26,80.01 EDGE.BC1
  Bottom 0.406: v102.87,66.67 97.79,61.59 v26.04,61.59
N$101  (via drill 0.81)
  Top 0.406: v20.96,83.82 8.26,83.82 EDGE.BD1
  Bottom 0.406: E11.1 101.6,83.82 v20.96,83.82
N$102  (via drill 0.81)
  Top 0.406: v15.88,58.42 8.26,58.42 EDGE.AV1
  Bottom 0.406: E11.13 100.33,80.01 98.43,80.01 97.79,79.38 97.79,62.87 22.86,62.87 18.42,58.42 v15.88,58.42
N$103  (via drill 0.81)
  Top 0.406: v15.88,56.52 14.61,55.24 8.26,55.24 EDGE.AU1
  Bottom 0.406: E11.12 109.86,67.94 109.86,59.69 20.96,59.69 17.78,56.52 v15.88,56.52
N$104  (via drill 0.81)
  Top 0.406: E13.12 95.25,100.33 95.25,106.05 92.71,108.58 v92.71,124.46
  Bottom 0.406: v92.71,124.46 89.54,127.64 8.26,127.64 EDGE.BV2
VCC
  Top 0.635: C11.1 105.41,81.28 105.41,95.25 E13.14 102.87,97.79 102.87,113.03 E15.14 | C12.1 66.04,87 64.77,85.72 64.77,81.28 C10.1 | 46.99,97.79 E12.8 | 46.99,97.79 46.99,113.03 E14.8 | E10.8 46.99,80.01 46.99,97.79 | C6.1 105.41,25.4 105.41,10.16 C3.1 | E6.8 87.63,24.13 87.63,8.89 E3.8 | C17.+ 27.31,71.75 27.31,9.53 C16.+ | E7.8 54.61,44.45 54.61,26.67 E4.8 | E11.14 105.41,77.47 105.41,48.26 C9.1
  Bottom 0.635: E15.14 105.41,115.57 C15.1 | E11.14 105.41,80.01 C11.1 | 104.78,97.16 105.41,97.79 C13.1 | 104.78,97.16 E13.14 102.87,97.79 C12.1 | R1.2 114.3,97.16 104.78,97.16 | E10.8 49.53,80.01 C10.1 | C14.1 49.53,115.57 E14.8 | E7.8 57.15,46.99 C7.1 77.47,46.99 | 77.47,46.99 E8.8 | 77.47,46.99 C8.1 87.63,46.99 | 87.63,46.99 E9.8 | 87.63,46.99 C9.1 | C17.+ 8.26,73.66 EDGE.BA2 | EDGE.AA2 8.26,4.45 22.23,4.45 C16.+ 27.94,5.08 54.61,5.08 C1.1 | E4.8 57.15,26.67 C4.1 59.69,27.94 73.66,27.94 E5.8 77.47,26.67 C5.1 87.63,26.67 E6.8 | E1.8 57.15,8.89 C1.1 | 77.47,8.89 E2.8 | 77.47,8.89 C2.1 87.63,8.89 | 87.63,8.89 E3.8 | 87.63,8.89 C3.1 | 77.47,8.89 C1.1

### Text on the board
Bottom: VRS | M7102 POSITIVE I/O BUS CONVERTER